# EAGLE schematic tsunami (EAGLE 7.7.0)

## Sheet 1 of 2
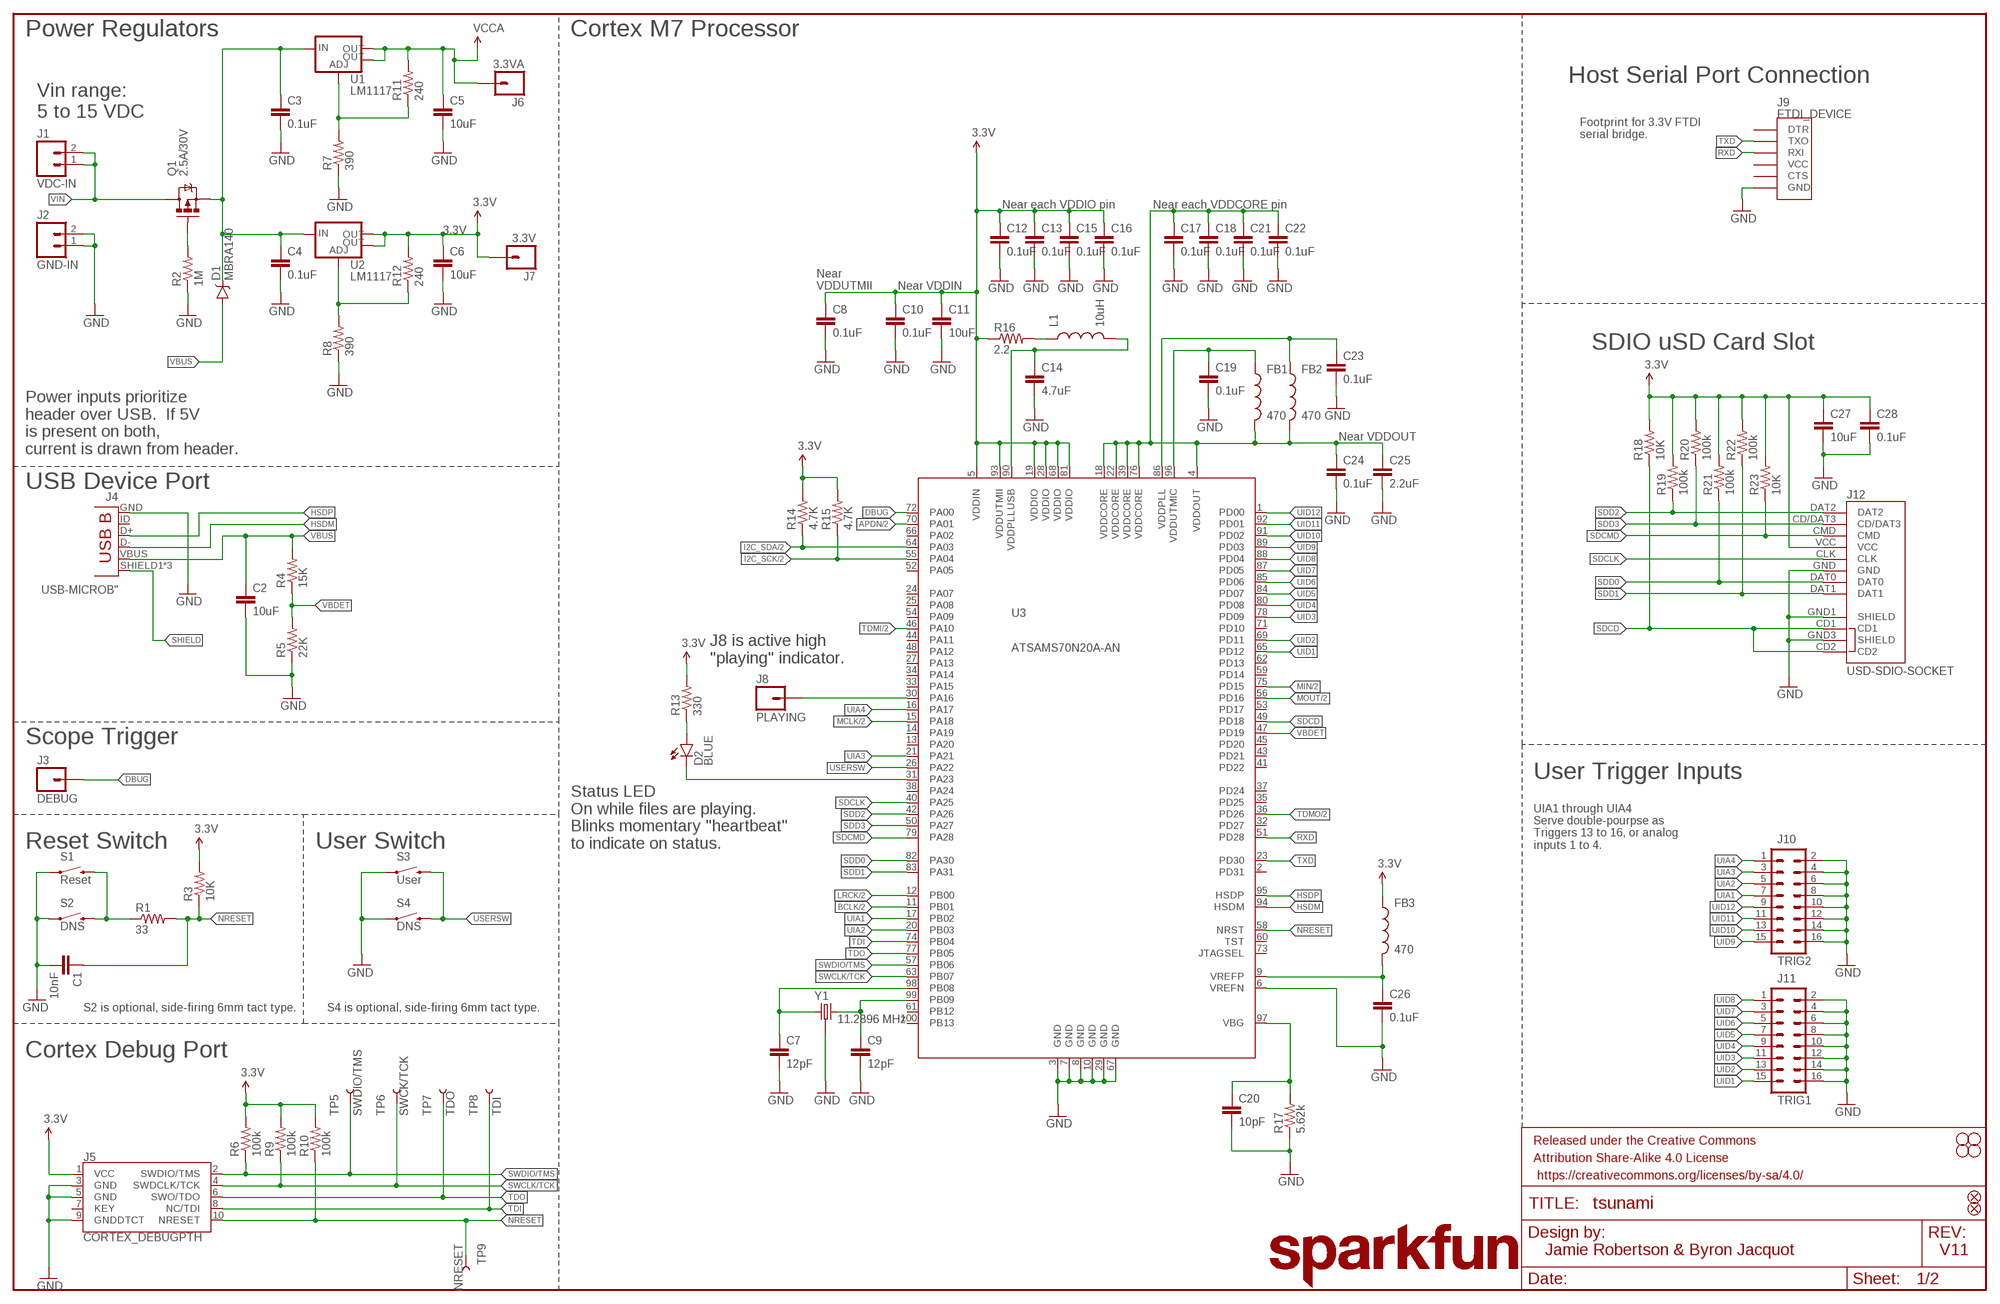
[diagram p0: schematic, sheet 1]

### Parts
C1  10nF  10NF/10000PF-50V-10%(0603)  [0603-CAP]
C2  10uF  10UF-6.3V-20%(0603)  [0603-CAP]
C3  0.1uF  0.1UF-25V(+80/-20%)(0603)  [0603-CAP]
C4  0.1uF  0.1UF-25V(+80/-20%)(0603)  [0603-CAP]
C5  10uF  10UF-6.3V-20%(0603)  [0603-CAP]
C6  10uF  10UF-6.3V-20%(0603)  [0603-CAP]
C7  12pF  12PF-50V-5%(0603)  [0603-CAP]
C8  0.1uF  0.1UF-25V(+80/-20%)(0603)  [0603-CAP]
C9  12pF  12PF-50V-5%(0603)  [0603-CAP]
C10  0.1uF  0.1UF-25V(+80/-20%)(0603)  [0603-CAP]
C11  10uF  10UF-6.3V-20%(0603)  [0603-CAP]
C12  0.1uF  0.1UF-25V(+80/-20%)(0603)  [0603-CAP]
C13  0.1uF  0.1UF-25V(+80/-20%)(0603)  [0603-CAP]
C14  4.7uF  4.7UF-6.3V-10%(0603)0603  [0603-CAP]
C15  0.1uF  0.1UF-25V(+80/-20%)(0603)  [0603-CAP]
C16  0.1uF  0.1UF-25V(+80/-20%)(0603)  [0603-CAP]
C17  0.1uF  0.1UF-25V(+80/-20%)(0603)  [0603-CAP]
C18  0.1uF  0.1UF-25V(+80/-20%)(0603)  [0603-CAP]
C19  0.1uF  0.1UF-25V(+80/-20%)(0603)  [0603-CAP]
C20  10pF  10PF-50V-5%(0603)  [0603-CAP]
C21  0.1uF  0.1UF-25V(+80/-20%)(0603)  [0603-CAP]
C22  0.1uF  0.1UF-25V(+80/-20%)(0603)  [0603-CAP]
C23  0.1uF  0.1UF-25V(+80/-20%)(0603)  [0603-CAP]
C24  0.1uF  0.1UF-25V(+80/-20%)(0603)  [0603-CAP]
C25  2.2uF  2.2UF-10V-20%(0603)  [0603-CAP]
C26  0.1uF  0.1UF-25V(+80/-20%)(0603)  [0603-CAP]
C27  10uF  10UF-6.3V-20%(0603)  [0603-CAP]
C28  0.1uF  0.1UF-25V(+80/-20%)(0603)  [0603-CAP]
D1  MBRA140  DIODE-SCHOTTKY-MBRA140  [SMA-DIODE]
D2  BLUE  LED-BLUE0603  [LED-0603]
FB1  470  INDUCTOR0603  [0603]
FB2  470  INDUCTOR0603  [0603]
FB3  470  INDUCTOR0603  [0603]
FD1  FIDUCIALUFIDUCIAL  [MICRO-FIDUCIAL]
FD2  FIDUCIALUFIDUCIAL  [MICRO-FIDUCIAL]
FRAME1  FRAME-LEDGER  [CREATIVE_COMMONS]
H1  STAND-OFF  [STAND-OFF]
H2  STAND-OFF  [STAND-OFF]
H3  STAND-OFF  [STAND-OFF]
H4  STAND-OFF  [STAND-OFF]
J1  VDC-IN  M02PTH  [1X02]
J2  GND-IN  M02PTH  [1X02]
J3  DEBUG  M01PTH_NO_SILK_YES_STOP  [1X01_NO_SILK]
J4  USB-MICROB"  [USB-B-MICRO-SMD_V03]
J5  CORTEX_DEBUGPTH  [2X5-PTH-1.27MM]
J6  3.3VA  M01PTH_NO_SILK_YES_STOP  [1X01_NO_SILK]
J7  3.3V  M01PTH_NO_SILK_YES_STOP  [1X01_NO_SILK]
J8  PLAYING  M01PTH_NO_SILK_YES_STOP  [1X01_NO_SILK]
J9  FTDI_DEVICE  [FTDI_DEVICE_SIDE]
J10  TRIG2  M08X2  [2X8]
J11  TRIG1  M08X2  [2X8]
J12  USD-SDIO-SOCKET  [MICRO-SD-SOCKET-SDIO]
L1  10uH  INDUCTOR0805  [0805]
LOGO1  SFE_LOGO_NAME.2_INCH  [SFE_LOGO_NAME_.2]
Q1  2.5A/30V  MOSFET-PCHANNELDMG2307L  [SOT23-3]
R1  33  33OHM1/10W1%(0603)  [0603-RES]
R2  1M  1MOHM-1/10W-1%(0603)  [0603-RES]
R3  10K  10KOHM-1/10W-1%(0603)0603  [0603-RES]
R4  15K  15KOHM1/10W1%(0603)0603  [0603-RES]
R5  22K  22KOHM1/10W1%(0603)  [0603-RES]
R6  100k  100KOHM-1/10W-1%(0603)  [0603-RES]
R7  390  390OHM1/10W1%(0603)  [0603-RES]
R8  390  390OHM1/10W1%(0603)  [0603-RES]
R9  100k  100KOHM-1/10W-1%(0603)  [0603-RES]
R10  100k  100KOHM-1/10W-1%(0603)  [0603-RES]
R11  240  240OHM1/10W1%(0603)  [0603-RES]
R12  240  240OHM1/10W1%(0603)  [0603-RES]
R13  330  330OHM1/10W1%(0603)  [0603-RES]
R14  4.7K  4.7KOHM-1/10W-1%(0603)  [0603-RES]
R15  4.7K  4.7KOHM-1/10W-1%(0603)  [0603-RES]
R16  2.2  2.2OHM-1/10W-5%(0603)  [0603-RES]
R17  5.62k  5.62KOHM1/10W1%(0603)  [0603-RES]
R18  10K  10KOHM-1/10W-1%(0603)0603  [0603-RES]
R19  100k  100KOHM-1/10W-1%(0603)  [0603-RES]
R20  100k  100KOHM-1/10W-1%(0603)  [0603-RES]
R21  100k  100KOHM-1/10W-1%(0603)  [0603-RES]
R22  100k  100KOHM-1/10W-1%(0603)  [0603-RES]
R23  10K  10KOHM-1/10W-1%(0603)0603  [0603-RES]
S1  Reset  SWITCH-MOMENTARY-2SMD  [TACTILE-SWITCH-SMD]
S2  DNS  SWITCH-MOMENTARY-2SIDE_EZ  [TACTILE-PTH-SIDEEZ]
S3  User  SWITCH-MOMENTARY-2SMD  [TACTILE-SWITCH-SMD]
S4  DNS  SWITCH-MOMENTARY-2SIDE_EZ  [TACTILE-PTH-SIDEEZ]
TP5  SWDIO/TMS  TEST-POINTTP_15TH_THRU  [TP_15TH]
TP6  SWCK/TCK  TEST-POINTTP_15TH_THRU  [TP_15TH]
TP7  TDO  TEST-POINTTP_15TH_THRU  [TP_15TH]
TP8  TDI  TEST-POINTTP_15TH_THRU  [TP_15TH]
TP9  NRESET  TEST-POINTTP_15TH_THRU  [TP_15TH]
U1  LM1117  V_REG_LM1117SOT223  [SOT223]
U2  LM1117  V_REG_LM1117SOT223  [SOT223]
U3  ATSAMS70N20A-AN  ATSAMS70NXXA-AN  [LQFP100]
Y1  11.2896 MHz  CRYSTAL-11.2896  [CRYSTAL-OSC-SMD-5X3]

### Nets
3.3V: C6.1 C8.1 C10.1 C11.1 C12.1 C13.1 C15.1 C16.1 C27.1 C28.1 FB3.1 J5.1(VCC) J7.1 J12.VCC R3.2 R6.2 R9.2 R10.2 R12.2 R13.2 R14.2 R15.2 R16.1 R18.2 R19.2 R20.2 R21.2 R22.2 R23.2 U2.2(OUT) U2.4(OUT) U3.5(VDDIN) U3.19(VDDIO) U3.28(VDDIO) U3.68(VDDIO) U3.81(VDDIO) U3.93(VDDUTMII) ; also sheet 2
APDN: U3.70(PA01) ; also sheet 2
BCLK: U3.11(PB01) ; also sheet 2
DBUG: J3.1 U3.72(PA00)
GND: C1.2 C2.2 C3.2 C4.2 C5.2 C6.2 C7.2 C8.2 C9.2 C10.2 C11.2 C12.2 C13.2 C14.2 C15.2 C16.2 C17.2 C18.2 C19.2 C20.2 C21.2 C22.2 C23.2 C24.2 C25.2 C26.2 C27.2 C28.2 J2.1 J2.2 J4.GND J5.3(GND) J5.5(GND) J5.9(GNDDTCT) J9.P$6(GND) J10.2 J10.4 J10.6 J10.8 J10.10 J10.12 J10.14 J10.16 J11.2 J11.4 J11.6 J11.8 J11.10 J11.12 J11.14 J11.16 J12.GND J12.GND1(SHIELD) J12.GND3(SHIELD) R2.1 R5.1 R7.1 R8.1 R17.1 S1.1 S2.1 S3.1 S4.1 U3.3(GND) U3.6(VREFN) U3.7(GND) U3.8(GND) U3.10(GND) U3.29(GND) U3.67(GND) Y1.2 Y1.4 ; also sheet 2
HSDM: J4.D- U3.94(HSDM)
HSDP: J4.D+ U3.95(HSDP)
I2C_SCK: R15.1 U3.55(PA04) ; also sheet 2
I2C_SDA: R14.1 U3.64(PA03) ; also sheet 2
LRCK: U3.12(PB00) ; also sheet 2
MCLK: U3.15(PA18) ; also sheet 2
MIN: U3.75(PD15) ; also sheet 2
MOUT: U3.56(PD16) ; also sheet 2
N$1: C7.1 U3.98(PB08) Y1.1
N$2: C9.1 U3.99(PB09) Y1.3
N$3: C19.1 FB1.1 U3.96(VDDUTMIC)
N$4: C14.1 L1.2 U3.90(VDDPLLUSB)
N$5: C23.1 FB2.1 U3.86(VDDPLL)
N$8: J8.1 U3.30(PA16)
N$10: D2.C U3.31(PA23)
N$11: D2.A R13.1
N$16: C20.1 R17.2 U3.97(VBG)
N$17: C26.1 FB3.2 U3.9(VREFP)
N$24: L1.1 R16.2
N$25: R7.2 R11.1 U1.1(ADJ)
N$26: R1.1 S1.3 S2.2
N$29: R8.2 R12.1 U2.1(ADJ)
N$75: Q1.1(G) R2.2
NRESET: C1.1 J5.10(NRESET) R1.2 R3.1 R10.1 TP9.P$1 U3.58(NRST)
REGINPUTS: C3.1 C4.1 D1.C Q1.2(S) U1.3(IN) U2.3(IN)
RXD: J9.P$3(RXI) U3.51(PD28)
SDCD: J12.CD1 J12.CD2 R18.1 U3.49(PD18)
SDCLK: J12.CLK U3.40(PA25)
SDCMD: J12.CMD R23.1 U3.79(PA28)
SDD0: J12.DAT0 R21.1 U3.82(PA30)
SDD1: J12.DAT1 R22.1 U3.83(PA31)
SDD2: J12.DAT2 R19.1 U3.42(PA26)
SDD3: J12.CD/DAT3 R20.1 U3.50(PA27)
SHIELD: J4.SHIELD1(SHIELD) J4.SHIELD2(SHIELD) J4.SHIELD3(SHIELD)
SWCLK/TCK: J5.4(SWDCLK/TCK) R9.1 TP6.P$1 U3.63(PB07)
SWDIO/TMS: J5.2(SWDIO/TMS) R6.1 TP5.P$1 U3.57(PB06)
TDI: J5.8(NC/TDI) TP8.P$1 U3.74(PB04)
TDMI: U3.46(PA10) ; also sheet 2
TDMO: U3.36(PD26) ; also sheet 2
TDO: J5.6(SWO/TDO) TP7.P$1 U3.77(PB05)
TXD: J9.P$2(TXO) U3.23(PD30)
UIA1: J10.7 U3.17(PB02)
UIA2: J10.5 U3.20(PB03)
UIA3: J10.3 U3.21(PA21)
UIA4: J10.1 U3.16(PA17)
UID1: J11.15 U3.65(PD12)
UID2: J11.13 U3.69(PD11)
UID3: J11.11 U3.78(PD09)
UID4: J11.9 U3.80(PD08)
UID5: J11.7 U3.84(PD07)
UID6: J11.5 U3.85(PD06)
UID7: J11.3 U3.87(PD05)
UID8: J11.1 U3.88(PD04)
UID9: J10.15 U3.89(PD03)
UID10: J10.13 U3.91(PD02)
UID11: J10.11 U3.92(PD01)
UID12: J10.9 U3.1(PD00)
USERSW: S3.3 S4.2 U3.26(PA22)
VBDET: R4.1 R5.2 U3.47(PD19)
VBUS: C2.1 D1.A J4.VBUS R4.2
VCCA: C5.1 J6.1 R11.2 U1.2(OUT) U1.4(OUT) ; also sheet 2
VDDOUT: C17.1 C18.1 C21.1 C22.1 C24.1 C25.1 FB1.2 FB2.2 U3.4(VDDOUT) U3.18(VDDCORE) U3.22(VDDCORE) U3.39(VDDCORE) U3.76(VDDCORE)
VIN: J1.1 J1.2 Q1.3(D)
Unconnected: J4.ID(USBID) J5.7(KEY) J9.P$1(DTR) J9.P$4(VCC) J9.P$5(CTS) U3.2(PD31) U3.13(PA20) U3.14(PA19) U3.24(PA07) U3.25(PA08) U3.27(PA13) U3.32(PD27) U3.33(PA15) U3.34(PA14) U3.35(PD25) U3.37(PD24) U3.38(PA24) U3.41(PD22) U3.43(PD21) U3.44(PA11) U3.45(PD20) U3.48(PA12) U3.52(PA05) U3.53(PD17) U3.54(PA09) U3.59(PD14) U3.60(TST) U3.61(PB12) U3.62(PD13) U3.66(PA02) U3.71(PD10) U3.73(JTAGSEL) U3.100(PB13)

### Notes on the sheet
- Power Regulators | Cortex M7 Processor
- Host Serial Port Connection
- Vin range:
  5 to 15 VDC
- Footprint for 3.3V FTDI
  serial bridge.
- Near each VDDIO pin | Near each VDDCORE pin
- Near
  VDDUTMII
- Near VDDIN
- SDIO uSD Card Slot
- Near VDDOUT
- Power inputs prioritize 
  header over USB.  If 5V 
  is present on both, 
  current is drawn from header.
- USB Device Port
- J8 is active high
  "playing" indicator.
- Scope Trigger
- User Trigger Inputs
- Reset Switch | User Switch
- Status LED
  On while files are playing.
  Blinks momentary "heartbeat" 
  to indicate on status.
- UIA1 through UIA4
  Serve double-pourpse as
  Triggers 13 to 16, or analog
  inputs 1 to 4.
- S2 is optional, side-firing 6mm tact type. | S4 is optional, side-firing 6mm tact type.
- Cortex Debug Port
- Jamie Robertson & Byron Jacquot | V11

## Sheet 2 of 2
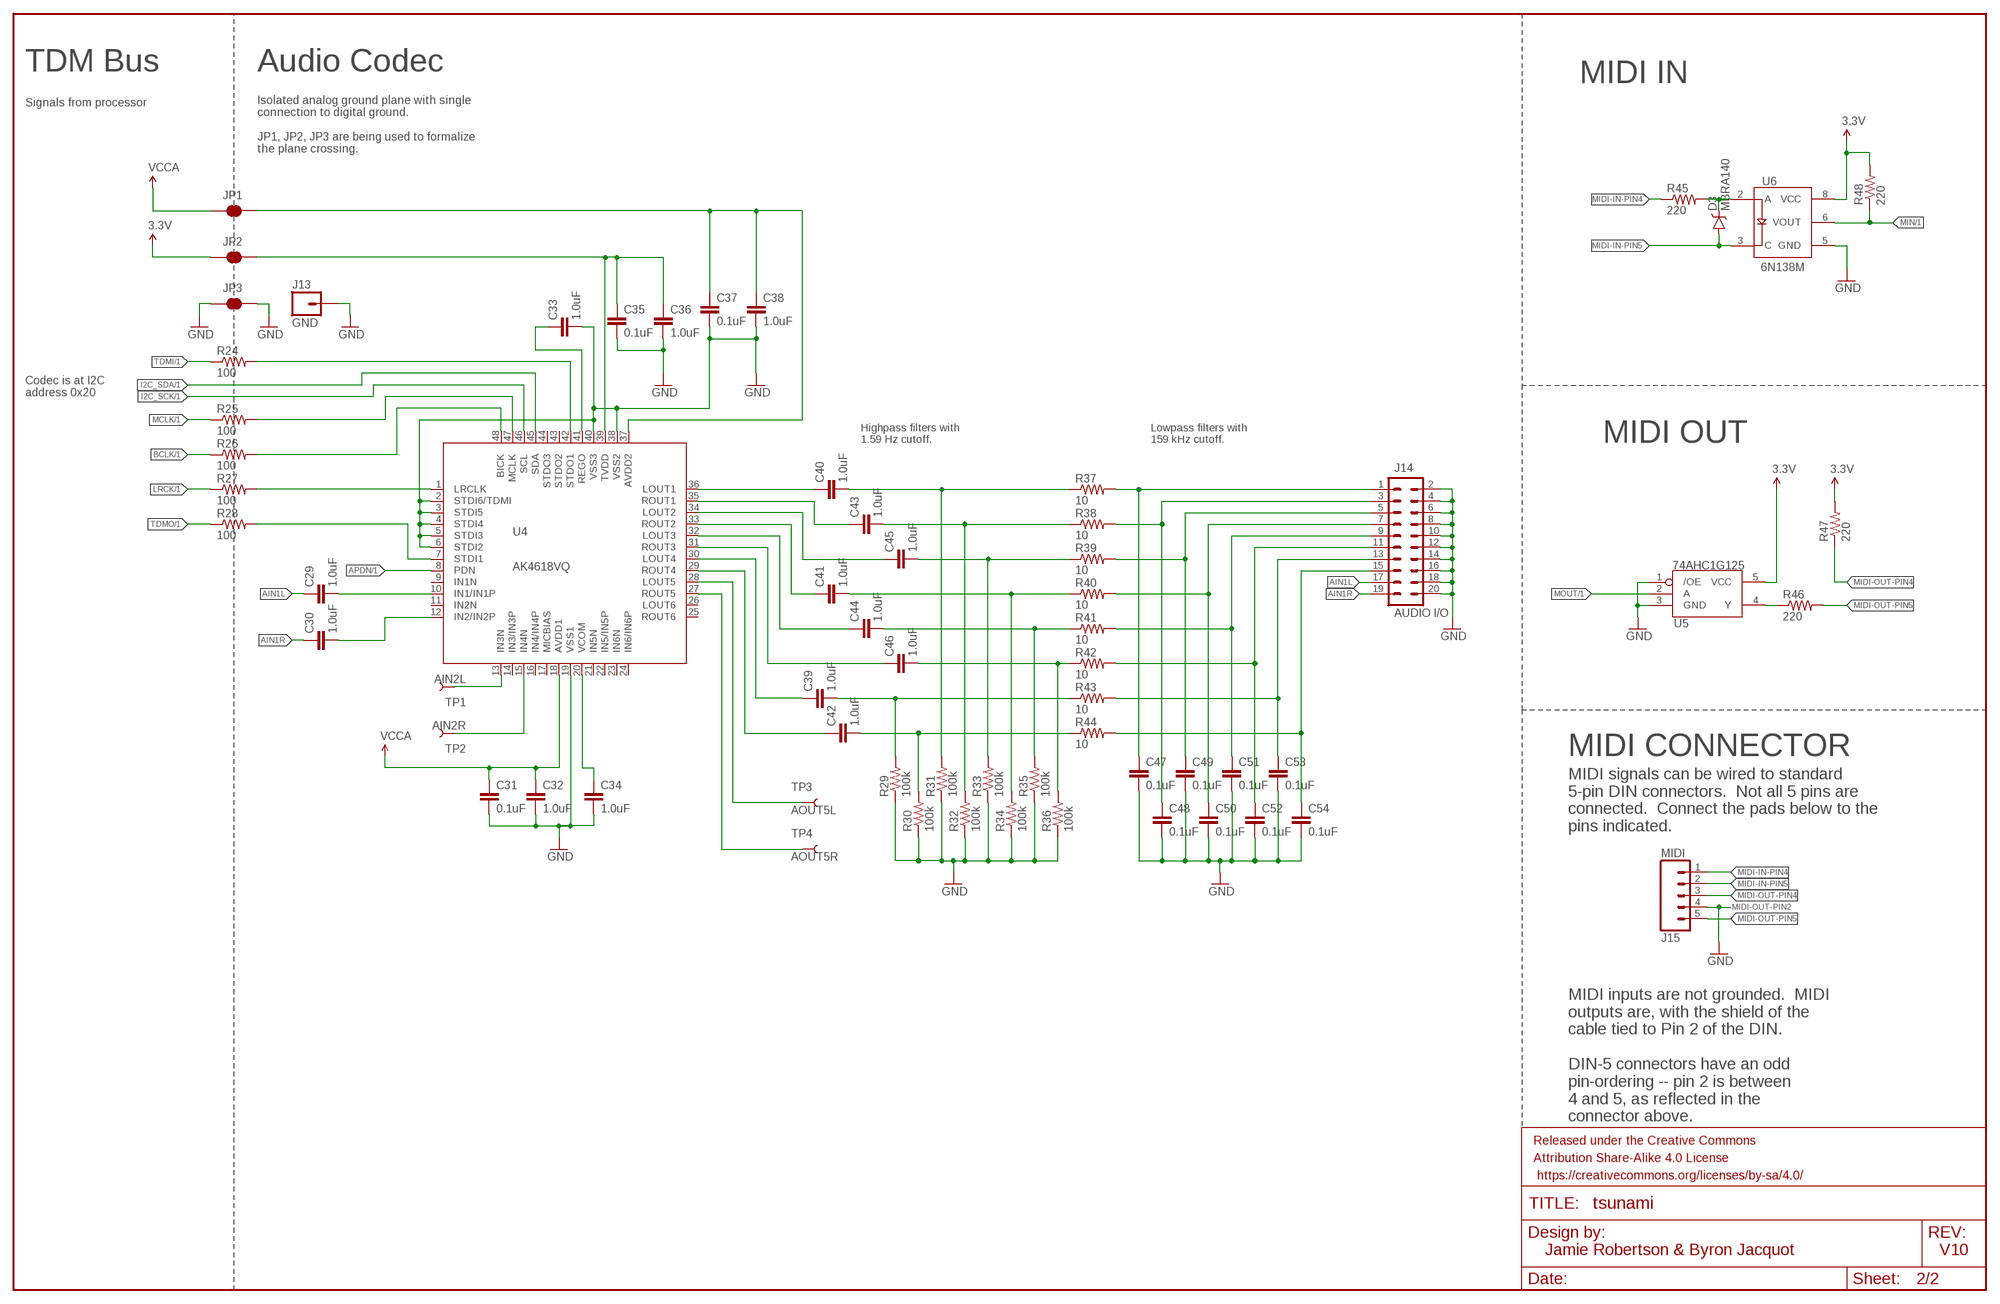
[diagram p1: schematic, sheet 2]

### Parts
C29  1.0uF  1.0UF-16V-10%(0603)  [0603-CAP]
C30  1.0uF  1.0UF-16V-10%(0603)  [0603-CAP]
C31  0.1uF  0.1UF-25V(+80/-20%)(0603)  [0603-CAP]
C32  1.0uF  1.0UF-16V-10%(0603)  [0603-CAP]
C33  1.0uF  1.0UF-16V-10%(0603)  [0603-CAP]
C34  1.0uF  1.0UF-16V-10%(0603)  [0603-CAP]
C35  0.1uF  0.1UF-25V(+80/-20%)(0603)  [0603-CAP]
C36  1.0uF  1.0UF-16V-10%(0603)  [0603-CAP]
C37  0.1uF  0.1UF-25V(+80/-20%)(0603)  [0603-CAP]
C38  1.0uF  1.0UF-16V-10%(0603)  [0603-CAP]
C39  1.0uF  1.0UF-16V-10%(0603)  [0603-CAP]
C40  1.0uF  1.0UF-16V-10%(0603)  [0603-CAP]
C41  1.0uF  1.0UF-16V-10%(0603)  [0603-CAP]
C42  1.0uF  1.0UF-16V-10%(0603)  [0603-CAP]
C43  1.0uF  1.0UF-16V-10%(0603)  [0603-CAP]
C44  1.0uF  1.0UF-16V-10%(0603)  [0603-CAP]
C45  1.0uF  1.0UF-16V-10%(0603)  [0603-CAP]
C46  1.0uF  1.0UF-16V-10%(0603)  [0603-CAP]
C47  0.1uF  0.1UF-25V-5%(0603)  [0603-CAP]
C48  0.1uF  0.1UF-25V-5%(0603)  [0603-CAP]
C49  0.1uF  0.1UF-25V-5%(0603)  [0603-CAP]
C50  0.1uF  0.1UF-25V-5%(0603)  [0603-CAP]
C51  0.1uF  0.1UF-25V-5%(0603)  [0603-CAP]
C52  0.1uF  0.1UF-25V-5%(0603)  [0603-CAP]
C53  0.1uF  0.1UF-25V-5%(0603)  [0603-CAP]
C54  0.1uF  0.1UF-25V-5%(0603)  [0603-CAP]
D3  MBRA140  [SMA-DIODE]
FRAME2  FRAME-LEDGER  [CREATIVE_COMMONS]
J13  GND  M01PTH_NO_SILK_YES_STOP  [1X01_NO_SILK]
J14  AUDIO I/O  M10X2  [2X10]
J15  MIDI  M05NO_SILK  [1X05_NO_SILK]
JP1  JUMPER-PAD-2-NC_BY_TRACENO_SILK  [PAD-JUMPER-2-NC_BY_TRACE_NO_SILK]
JP2  JUMPER-PAD-2-NC_BY_TRACENO_SILK  [PAD-JUMPER-2-NC_BY_TRACE_NO_SILK]
JP3  JUMPER-PAD-2-NC_BY_TRACENO_SILK  [PAD-JUMPER-2-NC_BY_TRACE_NO_SILK]
R24  100  100OHM-1/10W-1%(0603)  [0603-RES]
R25  100  100OHM-1/10W-1%(0603)  [0603-RES]
R26  100  100OHM-1/10W-1%(0603)  [0603-RES]
R27  100  100OHM-1/10W-1%(0603)  [0603-RES]
R28  100  100OHM-1/10W-1%(0603)  [0603-RES]
R29  100k  100KOHM-1/10W-1%(0603)  [0603-RES]
R30  100k  100KOHM-1/10W-1%(0603)  [0603-RES]
R31  100k  100KOHM-1/10W-1%(0603)  [0603-RES]
R32  100k  100KOHM-1/10W-1%(0603)  [0603-RES]
R33  100k  100KOHM-1/10W-1%(0603)  [0603-RES]
R34  100k  100KOHM-1/10W-1%(0603)  [0603-RES]
R35  100k  100KOHM-1/10W-1%(0603)  [0603-RES]
R36  100k  100KOHM-1/10W-1%(0603)  [0603-RES]
R37  10  10OHM-1/10W-1%(0603)SMD  [0603-RES]
R38  10  10OHM-1/10W-1%(0603)SMD  [0603-RES]
R39  10  10OHM-1/10W-1%(0603)SMD  [0603-RES]
R40  10  10OHM-1/10W-1%(0603)SMD  [0603-RES]
R41  10  10OHM-1/10W-1%(0603)SMD  [0603-RES]
R42  10  10OHM-1/10W-1%(0603)SMD  [0603-RES]
R43  10  10OHM-1/10W-1%(0603)SMD  [0603-RES]
R44  10  10OHM-1/10W-1%(0603)SMD  [0603-RES]
R45  220  220OHM-1/10W-1%(0603)  [0603-RES]
R46  220  220OHM-1/10W-1%(0603)  [0603-RES]
R47  220  220OHM-1/10W-1%(0603)  [0603-RES]
R48  220  220OHM-1/10W-1%(0603)  [0603-RES]
TP1  AIN2L  TEST-POINTTP_15TH_THRU  [TP_15TH]
TP2  AIN2R  TEST-POINTTP_15TH_THRU  [TP_15TH]
TP3  AOUT5L  TEST-POINTTP_15TH_THRU  [TP_15TH]
TP4  AOUT5R  TEST-POINTTP_15TH_THRU  [TP_15TH]
U4  AK4618VQ  AK4618VQSFE-PACKAGE  [LQFP-48]
U5  74AHC1G125  [SOT23-5]
U6  6N138M  OPTO_DARL_6N138S  [8-SMD]

### Nets
3.3V: C35.1 C36.1 JP2.1 JP2.2 R47.2 R48.2 U4.39(TVDD) U5.5(VCC) U6.8(VCC) ; also sheet 1
56: D3.C R45.2 U6.2(A)
AIN1L: C29.1 J14.17
AIN1R: C30.1 J14.19
AIN2L: TP1.P$1 U4.13(IN3N)
AIN2R: TP2.P$1 U4.15(IN4N)
AOUT1L: C47.1 J14.1 R37.2
AOUT1R: C48.1 J14.3 R38.2
AOUT2L: C49.1 J14.5 R39.2
AOUT2R: C50.1 J14.7 R40.2
AOUT3L: C51.1 J14.9 R41.2
AOUT3R: C52.1 J14.11 R42.2
AOUT4L: C53.1 J14.13 R43.2
AOUT4R: C54.1 J14.15 R44.2
APDN: U4.8(PDN) ; also sheet 1
BCLK: R26.1 ; also sheet 1
BCLK_C: R26.2 U4.48(BICK)
GND: C31.2 C32.2 C33.2 C34.2 C35.2 C36.2 C37.2 C38.2 C47.2 C48.2 C49.2 C50.2 C51.2 C52.2 C53.2 C54.2 J13.1 J14.2 J14.4 J14.6 J14.8 J14.10 J14.12 J14.14 J14.16 J14.18 J14.20 J15.4 JP3.1 JP3.2 R29.1 R30.1 R31.1 R32.1 R33.1 R34.1 R35.1 R36.1 U4.2(STDI6/TDMI) U4.3(STDI5) U4.4(STDI4) U4.5(STDI3) U4.6(STDI2) U4.19(VSS1) U4.38(VSS2) U4.40(VSS3) U5.1(/OE) U5.3(GND) U6.5(GND) ; also sheet 1
I2C_SCK: U4.46(SCL) ; also sheet 1
I2C_SDA: U4.45(SDA) ; also sheet 1
LRCK: R27.1 ; also sheet 1
LRCK_C: R27.2 U4.1(LRCLK)
MCLK: R25.1 ; also sheet 1
MCLK_C: R25.2 U4.47(MCLK)
MIDI-IN-PIN4: J15.1 R45.1
MIDI-IN-PIN5: D3.A J15.2 U6.3(C)
MIDI-OUT-PIN4: J15.3 R47.1
MIDI-OUT-PIN5: J15.5 R46.2
MIN: R48.1 U6.6(VOUT) ; also sheet 1
MOUT: U5.2(A) ; also sheet 1
N$6: C33.1 U4.41(REGO)
N$12: C34.1 U4.20(VCOM)
N$13: C40.1 U4.36(LOUT1)
N$14: C30.2 U4.12(IN2/IN2P)
N$15: C29.2 U4.10(IN1/IN1P)
N$18: C43.1 U4.35(ROUT1)
N$19: C45.1 U4.34(LOUT2)
N$20: C41.1 U4.33(ROUT2)
N$21: C44.1 U4.32(LOUT3)
N$22: C46.1 U4.31(ROUT3)
N$23: C40.2 R31.2 R37.1
N$27: C42.2 R30.2 R44.1
N$28: C39.2 R29.2 R43.1
N$30: C46.2 R36.2 R42.1
N$31: C39.1 U4.30(LOUT4)
N$32: C42.1 U4.29(ROUT4)
N$33: TP3.P$1 U4.28(LOUT5)
N$34: TP4.P$1 U4.27(ROUT5)
N$38: R46.1 U5.4(Y)
N$52: C44.2 R35.2 R41.1
N$53: C41.2 R34.2 R40.1
N$54: C43.2 R32.2 R38.1
N$55: C45.2 R33.2 R39.1
TDMI: R24.1 ; also sheet 1
TDMI_C: R24.2 U4.42(STDO1)
TDMO: R28.1 ; also sheet 1
TDMO_C: R28.2 U4.7(STDI1)
VCCA: C31.1 C32.1 C37.1 C38.1 JP1.1 JP1.2 U4.18(AVDD1) U4.37(AVDD2) ; also sheet 1
Unconnected: U4.9(IN1N) U4.11(IN2N) U4.14(IN3/IN3P) U4.16(IN4/IN4P) U4.17(MICBIAS) U4.21(IN5N) U4.22(IN5/IN5P) U4.23(IN6N) U4.24(IN6/IN6P) U4.25(ROUT6) U4.26(LOUT6) U4.43(STDO2) U4.44(STDO3)

### Notes on the sheet
- TDM Bus | Audio Codec
- MIDI IN
- Signals from processor
- Isolated analog ground plane with single
  connection to digital ground.
  
  JP1, JP2, JP3 are being used to formalize 
  the plane crossing.
- Codec is at I2C 
  address 0x20
- Highpass filters with
  1.59 Hz cutoff.
- Lowpass filters with
  159 kHz cutoff.
- MIDI OUT
- MIDI CONNECTOR
- MIDI signals can be wired to standard 
  5-pin DIN connectors.  Not all 5 pins are 
  connected.  Connect the pads below to the 
  pins indicated.
- MIDI-OUT-PIN2
- MIDI inputs are not grounded.  MIDI 
  outputs are, with the shield of the 
  cable tied to Pin 2 of the DIN.
  
  DIN-5 connectors have an odd 
  pin-ordering -- pin 2 is between 
  4 and 5, as reflected in the 
  connector above.
- Jamie Robertson & Byron Jacquot | V10

## Library data of the parts
C1 = SparkFun-Capacitors:10NF/10000PF-50V-10%(0603): CAP-00867; PROD_ID: CAP-00867
C2 C5 C6 C11 C27 = SparkFun-Capacitors:10UF-6.3V-20%(0603): CAP-11015; PROD_ID: CAP-11015
C3 C4 C8 C10 C12 C13 C15-C19 C21-C24 C26 C28 C31 C35 C37 = SparkFun-Capacitors:0.1UF-25V(+80/-20%)(0603): CAP-00810 Ceramic Standard decoupling cap; PROD_ID: CAP-00810
C7 C9 = SparkFun-Capacitors:12PF-50V-5%(0603): CAP-09137; PROD_ID: CAP-09137
C14 = SparkFun-Capacitors:4.7UF-6.3V-10%(0603): CAP-08280; PROD_ID: CAP-08280
C20 = SparkFun-Capacitors:10PF-50V-5%(0603): CAP-11812; PROD_ID: CAP-11812
C25 = SparkFun-Capacitors:2.2UF-10V-20%(0603): CAP-07888; PROD_ID: CAP-07888
C29 C30 C32-C34 C36 C38-C46 = SparkFun-Capacitors:1.0UF-16V-10%(0603): CAP-00868; PROD_ID: CAP-00868
C47-C54 = SparkFun-Capacitors:0.1UF-25V-5%(0603): CAP-08604; PROD_ID: CAP-08604
D1 = SparkFun-DiscreteSemi:DIODE-SCHOTTKY: Schottky diodes in SFE's production catalog BAT20J 1A 23V 0.62Vf RB751 120mA 40V 0.37Vf PMEG4005EJ 0.5A 40V 0.42Vf MBRA140 1A 40V 0.5Vf B340A 3A 40V SMA; PROD_ID: DIO-08053
D2 = SparkFun-LED:LED-BLUE: Blue LEDs for production use Various blue LEDs stocked by SparkFun production 0603 - DIO-08575 Rebel - DIO-09553 1206 - DIO-09911; PROD_ID: DIO-08575
D3 = SparkFun-DiscreteSemi:MBRA140: 40V, 1A Schottky rectifier SMA/DO-214AC package DIO-08053; PROD_ID: DIO-08053
FB1-FB3 = SparkFun-Passives:INDUCTOR: Inductors Basic Inductor/Choke - 0603 and 1206. Footprints are not proven and vary greatly between part numbers. INDUCTOR POWER 3.3UH 4.0A SMD 0.197" L x 0.197" W x 0.177" H (5.00mm x 5.00mm x 4.50mm); PROD_ID: NDUC-12579
FD1 FD2 = SparkFun-Aesthetics:FIDUCIAL: Fiducial Alignment Points Various fiducial points for machine vision alignment.
FRAME1 FRAME2 = SparkFun-Aesthetics:FRAME-LEDGER: Schematic Frame Standard 11x14 US Ledger frame
H1-H4 = SparkFun-Electromechanical:STAND-OFF: #4 Stand Off This is the mechanical footprint for a #4 phillips button head screw. Use the keepout ring to avoid running the screw head into surrounding components. SKU : PRT-00447
J1 J2 = SparkFun-Connectors:M02: Standard 2-pin 0.1" header. Use with - straight break away headers ( PRT-00116) - right angle break away headers (PRT-00553) - swiss pins (PRT-00743) - machine pins (PRT-00117) - female headers (PRT-00115) Molex polarized connector foot print use with: PRT-08233 with associated crimp pins and housings. 2.54_SCREWTERM for use with PRT-10571. 3.5mm Screw Terminal footprints for PRT-08084 5mm Screw Terminal footprints for use with PRT-08432
J3 J6-J8 J13 = SparkFun-Connectors:M01: Header 1 Standard 1-pin 0.1" header. Use with straight break away headers (SKU : PRT-00116), right angle break away headers (PRT-00553), swiss pins (PRT-00743), machine pins (PRT-00117), and female headers (PRT-00115). SMTSO-256-ET is a "flush mount" nut for a 4-40 screw. The older package used to be too tight, and did not allow it to sit properly thru the drill hit. The latest (0.165DIA) fits nice and snug.
J4 = SparkFun-Connectors:USB-MICROB; PROD_ID: CONN-11752
J5 = SparkFun-Connectors:CORTEX_DEBUG: Cortex Debug Connector Datasheet <http://infocenter.arm.com/help/topic/com.arm.doc.faqs/attached/13634/cortex_debug_connectors.pdf>
J9 = SparkFun-Connectors:FTDI_DEVICE: Connector which mates to FTDI basic or FTDI cable.
J10 J11 = SparkFun-Connectors:M08X2: .1" headers, two rows of 8 each
J12 = SparkFun-Connectors:USD-SDIO-SOCKET: microSD Socket Push-push type uSD socket with full SDIO signal mapping. Spark Fun Electronics SKU : PRT-00127. tDoc lines correctly indicate media card edge positions when inserting (unlocked, locked, depressed). NOTE: CD1 and CD2 are connected internally, and short to ground when card is removed.; PROD_ID: CONN-07820
J14 = SparkFun-Connectors:M10X2: This was SPECIALLY designed to be used with our Graphic LCD Backpack. Be sure you want to use this! It is not only staggered on each line of header holes, but IT IS ALSO offset of the center point of the top and bottom lines by 5 mil. This causes the headers to lock into place on the "standard" footprint on the LCD screen. The extra squares on the tdocu layer are there simply to reference other pins (if you were to actually populate a longer header than ten long - this is what we do with the backpacks).
J15 = SparkFun-Connectors:M05: Header 5 Standard 5-pin 0.1" header. Use with straight break away headers (SKU : PRT-00116), right angle break away headers (PRT-00553), swiss pins (PRT-00743), machine pins (PRT-00117), and female headers (PRT-00115). Molex polarized connector foot print use with SKU : PRT-08230 with associated crimp pins and housings.
JP1-JP3 = SparkFun-Passives:JUMPER-PAD-2-NC_BY_TRACE
L1 = SparkFun-Passives:INDUCTOR: Inductors Basic Inductor/Choke - 0603 and 1206. Footprints are not proven and vary greatly between part numbers. INDUCTOR POWER 3.3UH 4.0A SMD 0.197" L x 0.197" W x 0.177" H (5.00mm x 5.00mm x 4.50mm); PROD_ID: NDUC-13231
LOGO1 = SparkFun-Aesthetics:SFE_LOGO_NAME: SFE Logo, name only This is the SparkFun name logo. The logo on the schematic will always be the same size; the package variant is the height of the flame part of the logo (or the height the flame would be, if it were drawn). Default layer for the logo on the board is tSilk.
Q1 = SparkFun-DiscreteSemi:MOSFET-PCHANNEL: Generic PMOSFET IRLML2244 - TRANS-11153 (SOT-23 -20V -4.3A) (1.Gate 2.Source 3.Drain) FQP27P06 - COM-10349 <http://www.sparkfun.com/products/10349> (TO-220 -60V -27A) (1.Gate 2.Source 3.Drain); PROD_ID: TRANS-11308
R1 = SparkFun-Resistors:33OHM1/10W1%(0603): RES-08270; PROD_ID: RES-08270
R2 = SparkFun-Resistors:1MOHM-1/10W-1%(0603): RES-07868; PROD_ID: RES-07868
R3 R18 R23 = SparkFun-Resistors:10KOHM-1/10W-1%(0603): RES-00824; PROD_ID: RES-00824
R4 = SparkFun-Resistors:15KOHM1/10W1%(0603): RES-07854; PROD_ID: RES-07854
R5 = SparkFun-Resistors:22KOHM1/10W1%(0603): RES-07853; PROD_ID: RES-07853
R6 R9 R10 R19-R22 R29-R36 = SparkFun-Resistors:100KOHM-1/10W-1%(0603): RES-07828; PROD_ID: RES-07828
R7 R8 = SparkFun-Resistors:390OHM1/10W1%(0603): RES-07864; PROD_ID: RES-07864
R11 R12 = SparkFun-Resistors:240OHM1/10W1%(0603): RES-07849; PROD_ID: RES-07849
R13 = SparkFun-Resistors:330OHM1/10W1%(0603): RES-00818; PROD_ID: RES-00818
R14 R15 = SparkFun-Resistors:4.7KOHM-1/10W-1%(0603): RES-07857; PROD_ID: RES-07857
R16 = SparkFun-Resistors:2.2OHM-1/10W-5%(0603): RES-07823; PROD_ID: RES-07823
R17 = SparkFun-Resistors:5.62KOHM1/10W1%(0603): RES-09823; PROD_ID: RES-09823
R24-R28 = SparkFun-Resistors:100OHM-1/10W-1%(0603): RES-07863; PROD_ID: RES-07863
R37-R44 = SparkFun-Resistors:10OHM-1/10W-1%(0603): RES-12581; PROD_ID: RES-12581
R45-R48 = SparkFun-Resistors:220OHM-1/10W-1%(0603): RES-07861; PROD_ID: RES-07861
S1 S3 = SparkFun-Electromechanical:SWITCH-MOMENTARY-2: Various NO switches- pushbuttons, reed, etc; PROD_ID: SWCH-08247
S2 S4 = SparkFun-Electromechanical:SWITCH-MOMENTARY-2: Various NO switches- pushbuttons, reed, etc
TP1-TP9 = SparkFun-Passives:TEST-POINT: Bare copper test points for troubleshooting or ICT
U1 U2 = SparkFun-PowerIC:V_REG_LM1117: Voltage Regulator LM1117 Standard adjustable voltage regulator but in SMD form. Spark Fun Electronics SKU : COM-00595; PROD_ID: VREG-08170
U3 = tapestry:ATSAMS70NXXA-AN; PROD_ID: IC-13238
U4 = tapestry:AK4618VQ; PROD_ID: IC-13239
U5 = SparkFun-DigitalIC:74AHC1G125: Single bus buffer gate with 3-state output; PROD_ID: IC-11920
U6 = SparkFun-DiscreteSemi:OPTO_DARL_6N138S: Optoisolator, darlington pair output; PROD_ID: IC-09482
Y1 = tapestry:CRYSTAL-11.2896; DKPART: 887-2353-1-ND; MFR: txc; MFRPART: 7B-11.2896MAAE-T; PROD_ID: XTAL-13463